# Altium schematic sheet EQ_A.SchDoc
size A4
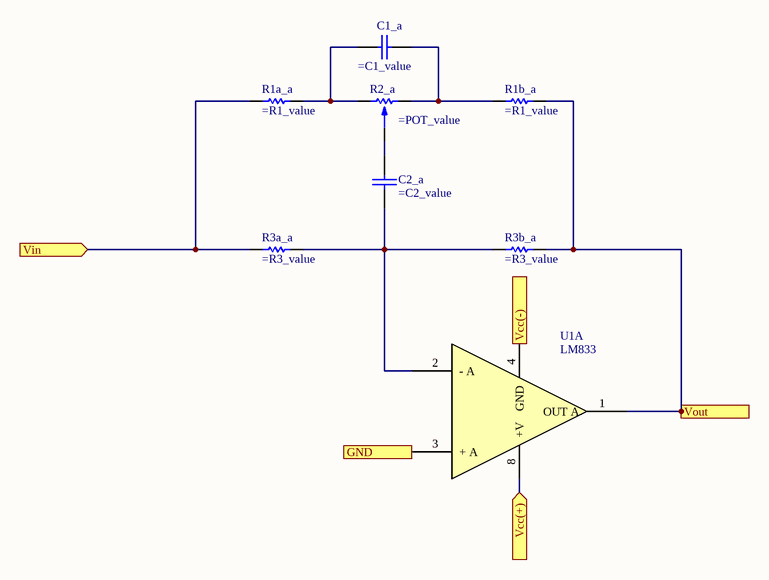
[diagram p0: EQ_A.SchDoc]

## Parts
C1_a  (no value)  [CAP200]
C2_a  (no value)  [CAP200]
R1a_a  (no value)  [0805]
R1b_a  (no value)  [0805]
R2_a  (no value)  [POTENCIOMETRO]
R3a_a  (no value)  [0805]
R3b_a  (no value)  [0805]
U1  LM833  [DIP8]  (part A of 2)

## Ports
GND, Vcc(+) (in), Vcc(-) (in), Vin (in), Vout (out)

## Nets
GND: U1.3(+_A) ; port GND
Vcc(+): U1.8(+V) ; port Vcc(+)
Vcc(-): U1.4(GND) ; port Vcc(-)
Vin: R1a_a.1 R3a_a.1 ; port Vin
Vout: R1b_a.2 R3b_a.2 U1.1(OUT_A) ; port Vout
NetC1_a_1: C1_a.1 R1a_a.2 R2_a.3
NetC1_a_2: C1_a.2 R1b_a.1 R2_a.1
NetC2_a_1: C2_a.1 R2_a.2
NetC2_a_2: C2_a.2 R3a_a.2 R3b_a.1 U1.2(-_A)

## Library data of the parts
C1_a C2_a = CAP
R1a_a R1b_a R3a_a R3b_a = RES
R2_a = POTENCIOMETRO
U1 = LM833: Dual Audio Operational Amplifier